# Altium project crypto_OK.PrjPcb
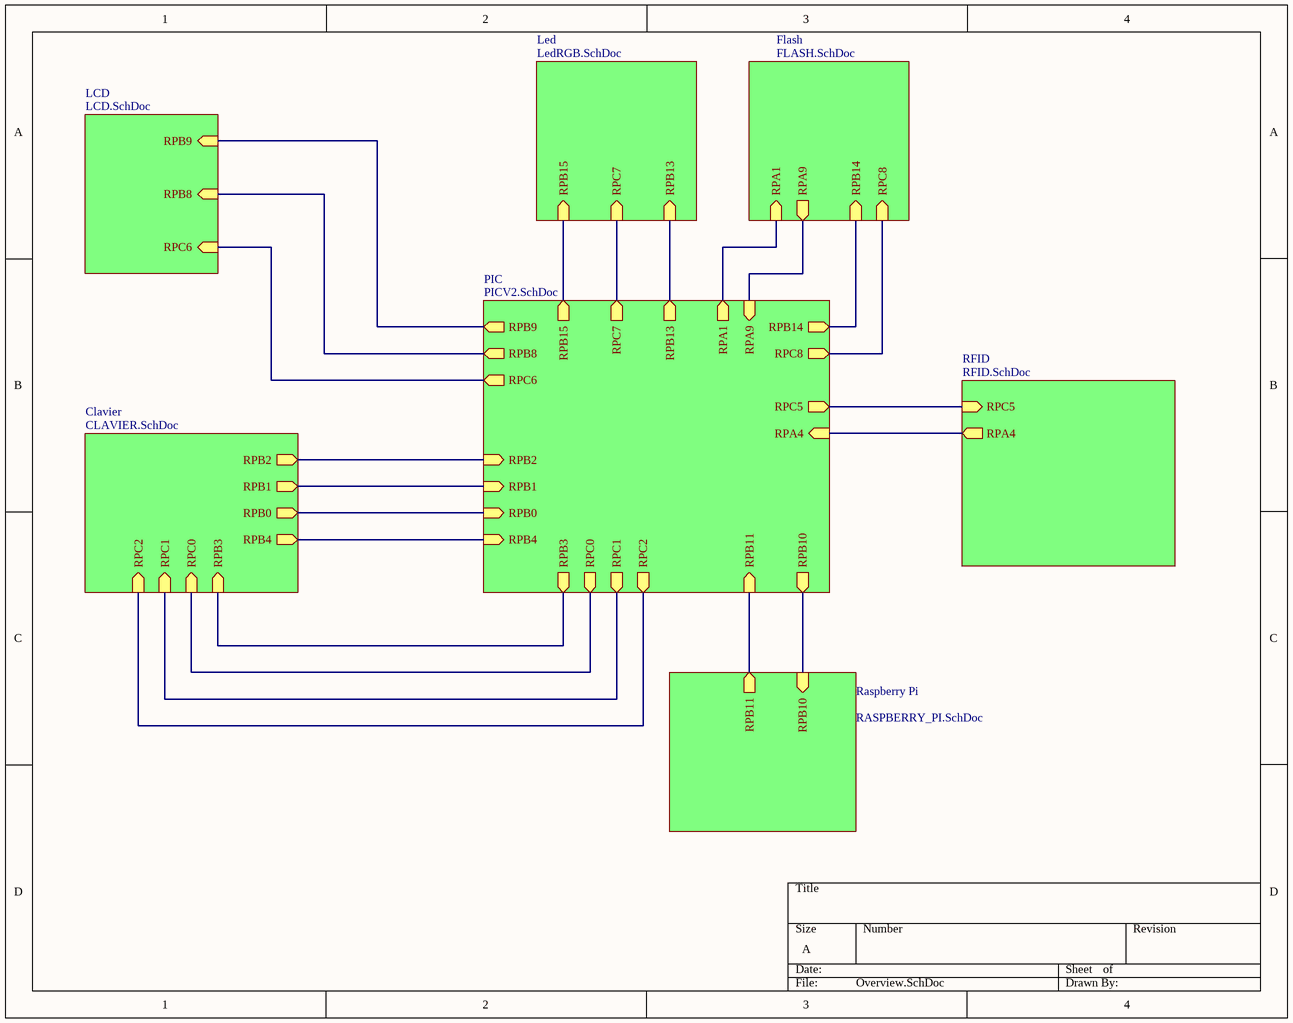
[diagram p0: Overview.SchDoc]
8 sheets, 37 parts. Net scope: hierarchical (ports join the sheet entries above them; power ports are global).
Board files: PCB1.PcbDoc, PCB2.PcbDoc, PCB3.PcbDoc, PCB4.PcbDoc
Sheets:
  Overview.SchDoc
    PIC = PICV2.SchDoc
    LCD = LCD.SchDoc
    Led = LedRGB.SchDoc
    RFID = RFID.SchDoc
    Clavier = CLAVIER.SchDoc
    Raspberry Pi = RASPBERRY_PI.SchDoc
    Flash = FLASH.SchDoc

## Sheet Overview.SchDoc
size A

### Sub-sheets
Clavier = CLAVIER.SchDoc: RPB2 (out), RPB1 (out), RPB0 (out), RPB4 (out), RPC1 (in), RPB3 (in), RPC0 (in), RPC2 (in)
Flash = FLASH.SchDoc: RPA1 (in), RPA9 (out), RPB14 (in), RPC8 (in)
LCD = LCD.SchDoc: RPB9 (in), RPB8 (in), RPC6 (in)
Led = LedRGB.SchDoc: RPB15 (in), RPC7 (in), RPB13 (in)
PIC = PICV2.SchDoc: RPB9 (out), RPB8 (out), RPC6 (out), RPB15 (out), RPC7 (out), RPB13 (out), RPA1 (out), RPA9 (in), RPB14 (out), RPC8 (out), RPC5 (out), RPA4 (in), RPB2 (in), RPB1 (in), RPB0 (in), RPB4 (in), RPB3 (out), RPC0 (out), RPC1 (out), RPC2 (out), RPB11 (in), RPB10 (out)
Raspberry Pi = RASPBERRY_PI.SchDoc: RPB11 (out), RPB10 (in)
RFID = RFID.SchDoc: RPC5 (in), RPA4 (out)

### Nets
NetP1_1: sheet PIC/RPC6, sheet LCD/RPC6
NetP1_12: sheet PIC/RPB8, sheet LCD/RPB8
NetP1_13: sheet PIC/RPB9, sheet LCD/RPB9
NetP4_3: sheet PIC/RPC5, sheet RFID/RPC5
NetP4_4: sheet PIC/RPA4, sheet RFID/RPA4
NetR3_2: sheet PIC/RPB15, sheet Led/RPB15
NetR4_2: sheet PIC/RPC7, sheet Led/RPC7
NetR5_2: sheet PIC/RPB13, sheet Led/RPB13
NetU2_1: sheet PIC/RPA1, sheet Flash/RPA1
NetU2_2: sheet PIC/RPA9, sheet Flash/RPA9
NetU2_5: sheet PIC/RPC8, sheet Flash/RPC8
NetU2_6: sheet PIC/RPB14, sheet Flash/RPB14
NetU3_8: sheet PIC/RPB10, sheet Raspberry Pi/RPB10
NetU3_9: sheet PIC/RPB11, sheet Raspberry Pi/RPB11
NetU3_21: sheet PIC/RPB0, sheet Clavier/RPB0
NetU3_22: sheet PIC/RPB1, sheet Clavier/RPB1
NetU3_23: sheet PIC/RPB2, sheet Clavier/RPB2
NetU3_24: sheet PIC/RPB3, sheet Clavier/RPB3
NetU3_25: sheet PIC/RPC0, sheet Clavier/RPC0
NetU3_26: sheet PIC/RPC1, sheet Clavier/RPC1
NetU3_27: sheet PIC/RPC2, sheet Clavier/RPC2
NetU3_33: sheet PIC/RPB4, sheet Clavier/RPB4

## Sheet PICV2.SchDoc
size B
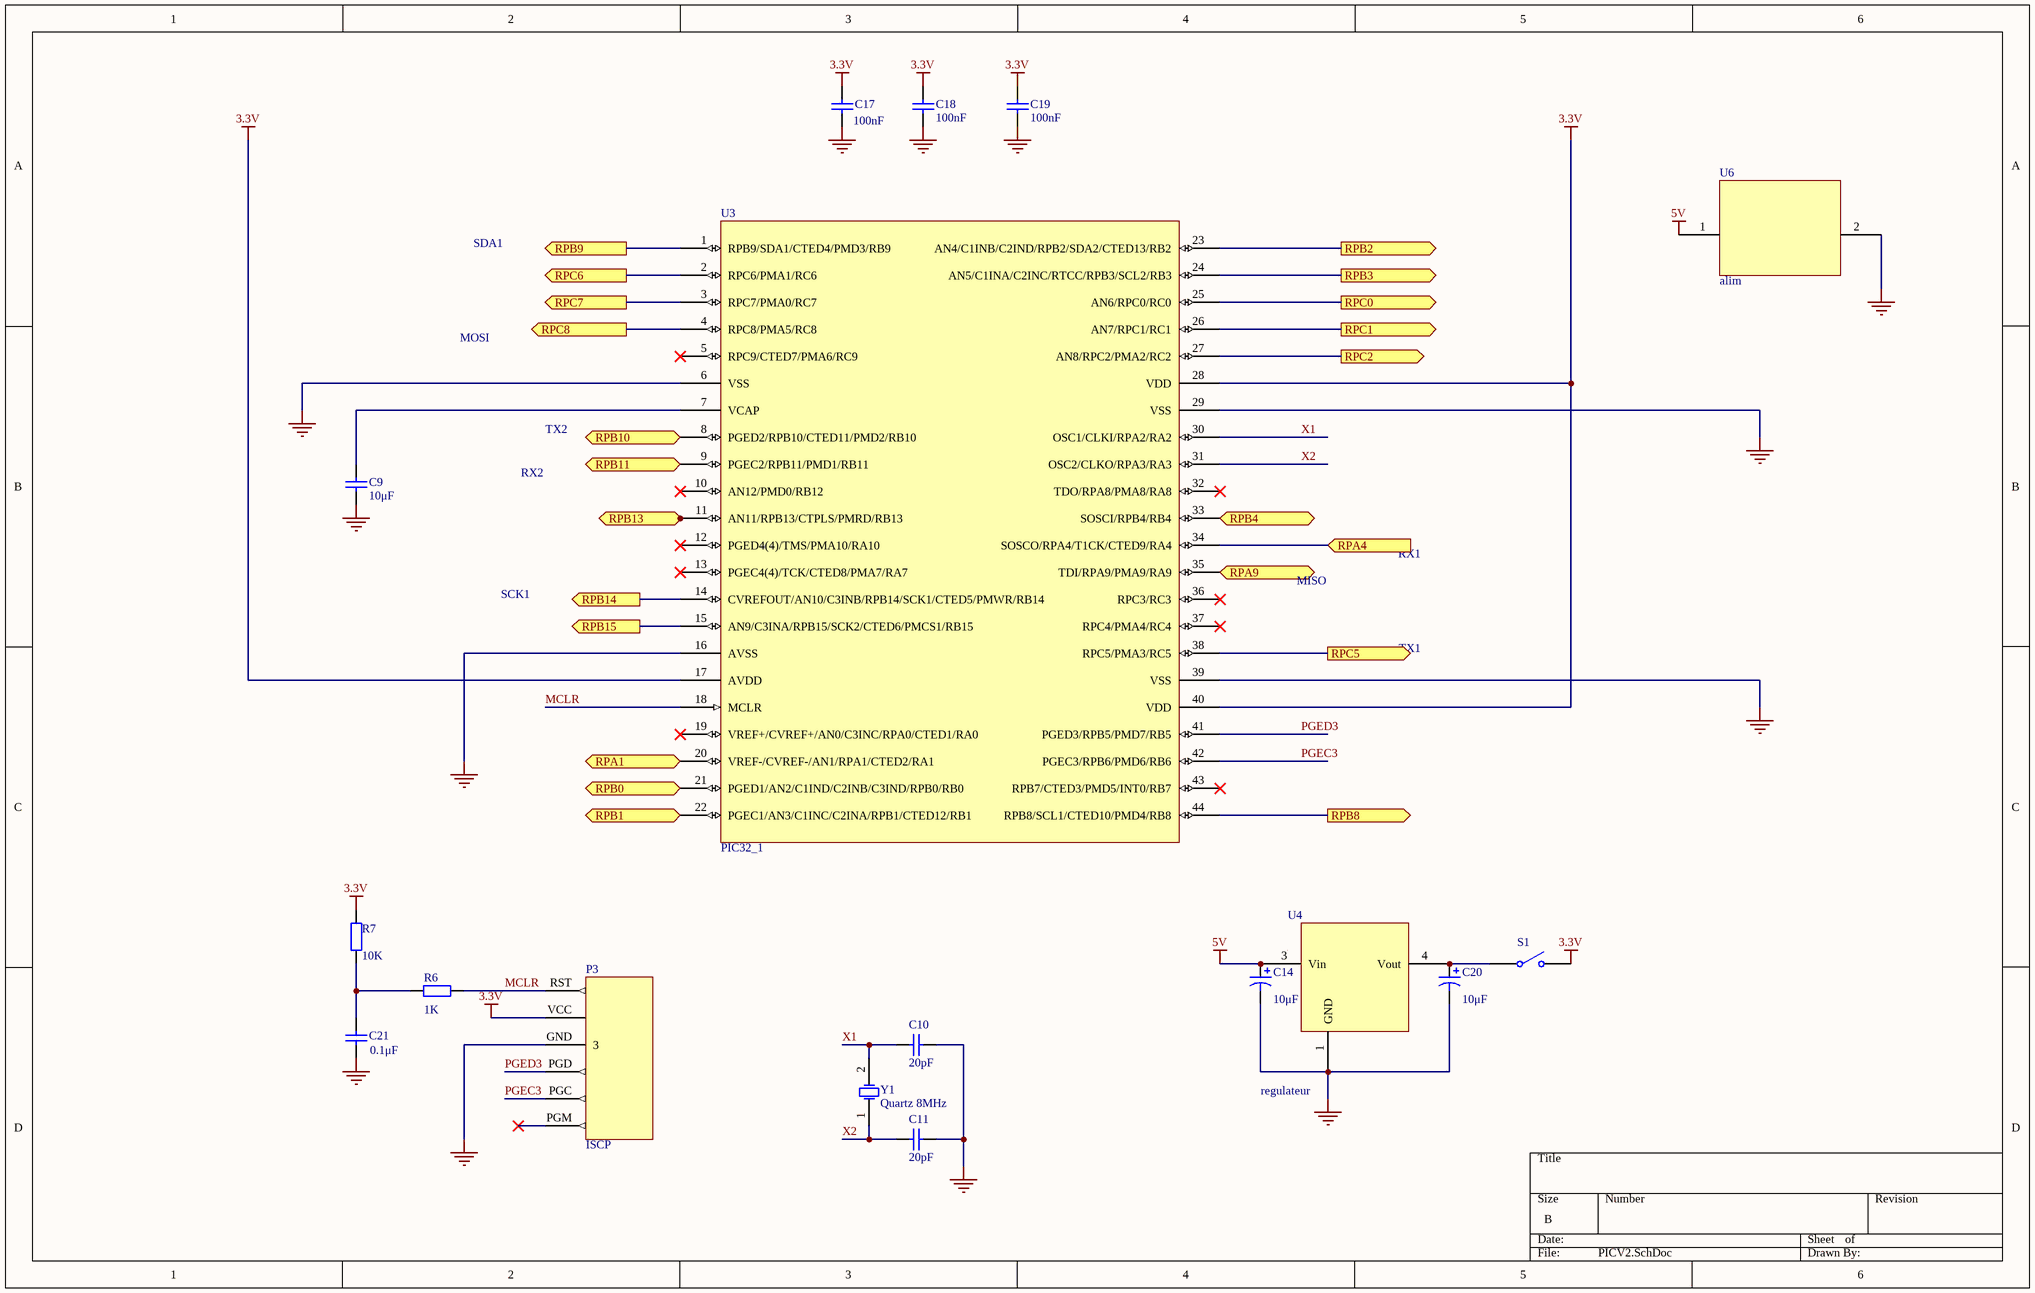
[diagram p1: PICV2.SchDoc]

### Parts
C9  value 10μF  [0603]  (hidden comment: Cap)
C10  value 20pF  [0603]  (hidden comment: Cap)
C11  value 20pF  [0603]  (hidden comment: Cap)
C14  value 10μF  [0603]  (hidden comment: Cap Pol1)
C17  value 100nF  [0603]  (hidden comment: Cap)
C18  value 100nF  [0603]  (hidden comment: Cap)
C19  value 100nF  [0603]  (hidden comment: Cap)
C20  value 10μF  [0603]  (hidden comment: Cap Pol1)
C21  value 0.1μF  [0603]  (hidden comment: Cap)
P3  ISCP  [ISCP]
R6  value 1K  [0603]  (hidden comment: Res2)
R7  value 10K  [0603]  (hidden comment: Res2)
S1  SW-SPST  [SPST-2]  (value not drawn)
U3  PIC32_1  [PIC32]
U4  regulateur  [regulateur]
U6  alim  [Alim]
Y1  Quartz 8MHz  [quartz]

### Ports
RPA1 (out), RPA4 (in), RPA9 (in), RPB0 (out), RPB1 (out), RPB2 (out), RPB3 (out), RPB4 (out), RPB8 (out), RPB9 (out), RPB10 (out), RPB11 (in), RPB13 (out), RPB14 (out), RPB15 (out), RPC0 (out), RPC1 (out), RPC2 (out), RPC5 (out), RPC6 (out), RPC7 (out), RPC8 (out)

### Nets
3.3V: C17.2 C18.1 C19.1 P3.VCC R7.2 S1.2(NO) U3.17(AVDD) U3.28(VDD) U3.40(VDD)
5V: C14.1 U4.3(Vin) U6.1
GND: C9.2 C10.1 C11.1 C14.2 C17.1 C18.2 C19.2 C20.2 C21.1 P3.GND(3) U3.6(VSS) U3.16(AVSS) U3.29(VSS) U3.39(VSS) U4.1(GND) U6.2
MCLR: P3.RST R6.2 U3.18(MCLR)
PGEC3: P3.PGC U3.42(PGEC3/RPB6/PMD6/RB6)
PGED3: P3.PGD U3.41(PGED3/RPB5/PMD7/RB5)
X1: C10.2 U3.30(OSC1/CLKI/RPA2/RA2) Y1.2(OSC2)
X2: C11.2 U3.31(OSC2/CLKO/RPA3/RA3) Y1.1(OSC1)
NetC9_1: C9.1 U3.7(VCAP)
NetC20_1: C20.1 S1.1(COMMON) U4.4(Vout)
NetC21_2: C21.2 R6.1 R7.1
NetP1_1: U3.2(RPC6/PMA1/RC6) ; port RPC6
NetP1_12: U3.44(RPB8/SCL1/CTED10/PMD4/RB8) ; port RPB8
NetP1_13: U3.1(RPB9/SDA1/CTED4/PMD3/RB9) ; port RPB9
NetP4_3: U3.38(RPC5/PMA3/RC5) ; port RPC5
NetP4_4: U3.34(SOSCO/RPA4/T1CK/CTED9/RA4) ; port RPA4
NetR3_2: U3.15(AN9/C3INA/RPB15/SCK2/CTED6/PMCS1/RB15) ; port RPB15
NetR4_2: U3.3(RPC7/PMA0/RC7) ; port RPC7
NetU2_1: U3.20(VREF-/CVREF-/AN1/RPA1/CTED2/RA1) ; port RPA1
NetU2_2: U3.35(TDI/RPA9/PMA9/RA9) ; port RPA9
NetU2_5: U3.4(RPC8/PMA5/RC8) ; port RPC8
NetU2_6: U3.14(CVREFOUT/AN10/C3INB/RPB14/SCK1/CTED5/PMWR/RB14) ; port RPB14
NetU3_8: U3.8(PGED2/RPB10/CTED11/PMD2/RB10) ; port RPB10
NetU3_9: U3.9(PGEC2/RPB11/PMD1/RB11) ; port RPB11
NetU3_21: U3.21(PGED1/AN2/C1IND/C2INB/C3IND/RPB0/RB0) ; port RPB0
NetU3_22: U3.22(PGEC1/AN3/C1INC/C2INA/RPB1/CTED12/RB1) ; port RPB1
NetU3_23: U3.23(AN4/C1INB/C2IND/RPB2/SDA2/CTED13/RB2) ; port RPB2
NetU3_24: U3.24(AN5/C1INA/C2INC/RTCC/RPB3/SCL2/RB3) ; port RPB3
NetU3_25: U3.25(AN6/RPC0/RC0) ; port RPC0
NetU3_26: U3.26(AN7/RPC1/RC1) ; port RPC1
NetU3_27: U3.27(AN8/RPC2/PMA2/RC2) ; port RPC2
NetU3_33: U3.33(SOSCI/RPB4/RB4) ; port RPB4

Not connected (* = marked no-connect by the designer): P3 PGM(6)*; U3 5(RPC9/CTED7/PMA6/RC9)* 10(AN12/PMD0/RB12)* 11(AN11/RPB13/CTPLS/PMRD/RB13) 12(PGED4(4)/TMS/PMA10/RA10)* 13(PGEC4(4)/TCK/CTED8/PMA7/RA7)* 19(VREF+/CVREF+/AN0/C3INC/RPA0/CTED1/RA0)* 32(TDO/RPA8/PMA8/RA8)* 36(RPC3/RC3)* 37(RPC4/PMA4/RC4)* 43(RPB7/CTED3/PMD5/INT0/RB7)*

### Notes on the sheet
- SDA1
- MOSI
- TX2
- RX2
- MISO
- RX1
- SCK1
- TX1

### Library data of the parts
C9-C11 C17-C19 C21 = Cap: Capacitor; Published: 8-Jun-2000; LatestRevisionDate: 17-Jul-2002; LatestRevisionNote: Re-released for DXP Platform.; PackageReference: RAD-0.3; Publisher: Altium Limited; PackageDescription: Radial Cap, Thru-Hole; 2 Leads; 0.3 in Pin Spacing
C14 = Cap Pol1: Polarized Capacitor (Radial); FOURNISSEUR: FARNELL; FABRIQUANT: TDK; REF FABRIQUANT: C1608X5R0J106K080AB; REF FOURNISSEUR: 2346889; Published: 8-Jun-2000; LatestRevisionDate: 17-Jul-2002; LatestRevisionNote: Re-released for DXP Platform.; PackageReference: RB7.6-15; Publisher: Altium Limited; PackageDescription: Polarized Capacitor (Radial); 2 Leads
C20 = Cap Pol1: Polarized Capacitor (Radial); FABRIQUANT: TDK; FOURNISSEUR: FARNELL; REF FABRIQUANT: C1608X5R0J106K080AB; REF FOURNISSEUR: 2346889; Published: 8-Jun-2000; LatestRevisionDate: 17-Jul-2002; LatestRevisionNote: Re-released for DXP Platform.; PackageReference: RB7.6-15; Publisher: Altium Limited; PackageDescription: Polarized Capacitor (Radial); 2 Leads
P3 = ISCP: FOURNISSEUR: Farnell; FABRIQUANT: Molex; REF FOURNISSEUR: 1360134; REF FABRIQUANT: 22-29-2061
R6 R7 = Res2: Resistor; Published: 8-Jun-2000; LatestRevisionDate: 17-Jul-2002; LatestRevisionNote: Re-released for DXP Platform.; PackageReference: AXIAL-0.4; Publisher: Altium Limited; PackageDescription: Axial Device, Thru-Hole; 2 Leads; 0.4 in Pin Spacing
S1 = SW-SPST: Single-Pole, Single-Throw Switch; Published: 24-Mar-1999; LatestRevisionDate: 17-Jul-2002; LatestRevisionNote: Re-released for DXP Platform.; PackageReference: SPST-2; Publisher: Altium Limited; PackageDescription: Switch; 2 Leads
U3 = PIC32_1: FOURNISSEUR: FARNELL; FABRIQUANT: MICROCHIP; REF FOURNISSEUR: PIC32MX170F256D-I/PT; REF FABRIQUANT: 2456845
U4 = regulateur: FOURNISSEUR: FARNELL; FABRIQUANT: TEXAS INSTRUMENTS; REF FABRIQUANT: LM1117DT-3.3/NOPB; REF FOURNISSEUR: 1469048
U6 = alim: FOURNISSEUR: Farnell; FABRIQUANT: Lumberg; REF FABRIQUANT: 1613 09; REF FOURNISSEUR: 1216991
Y1 = XTAL: Crystal Oscillator; FABRIQUANT: FOX ELECTRONICS; FOURNISSEUR: FARNELL; REF FABRIQUANT: FOXSDLF/080-20; REF FOURNISSEUR: 2063972; Published: 8-Jun-2000; LatestRevisionDate: 17-Jul-2002; LatestRevisionNote: Re-released for DXP Platform.; PackageReference: R38; Publisher: Altium Limited; PackageDescription: Crystal, Thru-Hole; 2 Leads; Body 3.1 x 8.2 mm (Dia.xH)

## Sheet LCD.SchDoc
size A
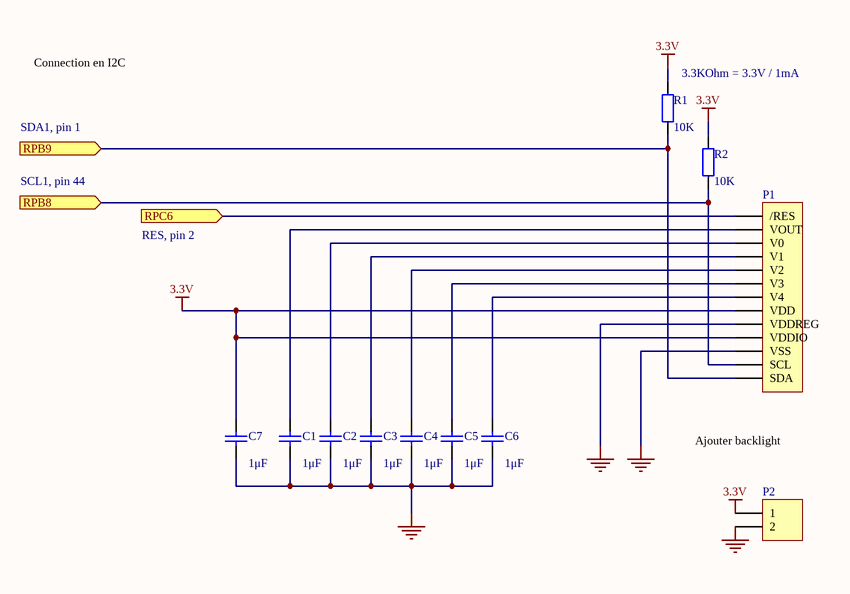
[diagram p2: LCD.SchDoc]

### Parts
C1  value 1μF  [0603]  (hidden comment: Cap)
C2  value 1μF  [0603]  (hidden comment: Cap)
C3  value 1μF  [0603]  (hidden comment: Cap)
C4  value 1μF  [0603]  (hidden comment: Cap)
C5  value 1μF  [0603]  (hidden comment: Cap)
C6  value 1μF  [0603]  (hidden comment: Cap)
C7  value 1μF  [0603]  (hidden comment: Cap)
P1  LCD  [lcd]  (value not drawn)
P2  lcd backlight  [lcd bk]  (value not drawn)
R1  value 10K  [0603]  (hidden comment: Res2)
R2  value 10K  [0603]  (hidden comment: Res2)

### Ports
RPB8 (in), RPB9 (in), RPC6 (in)

### Nets
3.3V: C7.2 P1.8(VDD) P1.10(VDDIO) P2.1 R1.2 R2.2
GND: C1.1 C2.1 C3.1 C4.1 C5.1 C6.1 C7.1 P1.9(VDDREG) P1.11(VSS) P2.2
NetC1_2: C1.2 P1.2(VOUT)
NetC2_2: C2.2 P1.3(V0)
NetC3_2: C3.2 P1.4(V1)
NetC4_2: C4.2 P1.5(V2)
NetC5_2: C5.2 P1.6(V3)
NetC6_2: C6.2 P1.7(V4)
NetP1_1: P1.1(/RES) ; port RPC6
NetP1_12: P1.12(SCL) R2.1 ; port RPB8
NetP1_13: P1.13(SDA) R1.1 ; port RPB9

### Notes on the sheet
- Connection en I2C
- (near R1) 3.3KOhm = 3.3V / 1mA
- SDA1, pin 1
- SCL1, pin 44
- RES, pin 2
- (near P2) Ajouter backlight

### Library data of the parts
C1-C7 = Cap: Capacitor; Published: 8-Jun-2000; LatestRevisionDate: 17-Jul-2002; LatestRevisionNote: Re-released for DXP Platform.; PackageReference: RAD-0.3; Publisher: Altium Limited; PackageDescription: Radial Cap, Thru-Hole; 2 Leads; 0.3 in Pin Spacing
P1 = Header 13: LCD Connector; REF FABRIQUANT: MCCOG42005A6W-BNMLWI; FABRIQUANT: MIDAS; FOURNISSEUR: FARNELL; REF FOURNISSEUR: 2218946; LatestRevisionDate: 17-Jul-2002; LatestRevisionNote: Re-released for DXP Platform.; Publisher: Altium Limited
P2 = Header 2H: Header, 2-Pin, Right Angle; FOURNISSEUR: Farnell; FABRIQUANT: PHOENIX CONTACT; REF FABRIQUANT: 1725656; REF FOURNISSEUR: 3041359
R1 R2 = Res2: Resistor; Published: 8-Jun-2000; LatestRevisionDate: 17-Jul-2002; LatestRevisionNote: Re-released for DXP Platform.; PackageReference: AXIAL-0.4; Publisher: Altium Limited; PackageDescription: Axial Device, Thru-Hole; 2 Leads; 0.4 in Pin Spacing

## Sheet LedRGB.SchDoc
size A
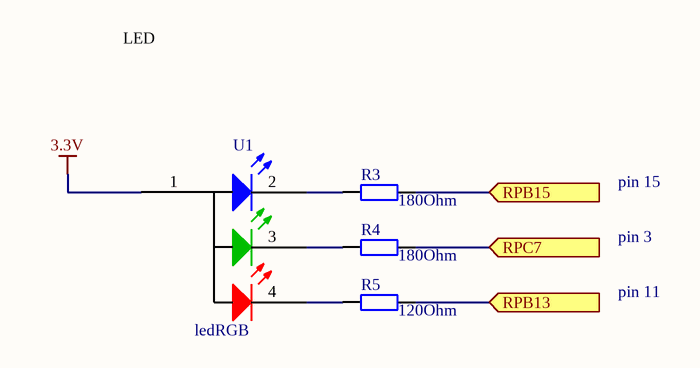
[diagram p3: LedRGB.SchDoc]

### Parts
R3  value 180Ohm  [0603]  (hidden comment: Res2)
R4  value 180Ohm  [0603]  (hidden comment: Res2)
R5  value 120Ohm  [0603]  (hidden comment: Res2)
U1  ledRGB  [LED RGB]

### Ports
RPB13 (in), RPB15 (in), RPC7 (in)

### Nets
3.3V: U1.1
NetR3_1: R3.1 U1.2
NetR3_2: R3.2 ; port RPB15
NetR4_1: R4.1 U1.3
NetR4_2: R4.2 ; port RPC7
NetR5_1: R5.1 U1.4
NetR5_2: R5.2 ; port RPB13

### Notes on the sheet
- LED
- pin 15
- pin 3
- pin 11

### Library data of the parts
R3-R5 = Res2: Resistor; Published: 8-Jun-2000; LatestRevisionDate: 17-Jul-2002; LatestRevisionNote: Re-released for DXP Platform.; PackageReference: AXIAL-0.4; Publisher: Altium Limited; PackageDescription: Axial Device, Thru-Hole; 2 Leads; 0.4 in Pin Spacing
U1 = ledRGB: FABRIQUANT: MIDAS; FOURNISSEUR: FARNELL; REF FABRIQUANT: AMB-MTB0-0A3A2; REF FOURNISSEUR: 2401105

## Sheet RFID.SchDoc
size A
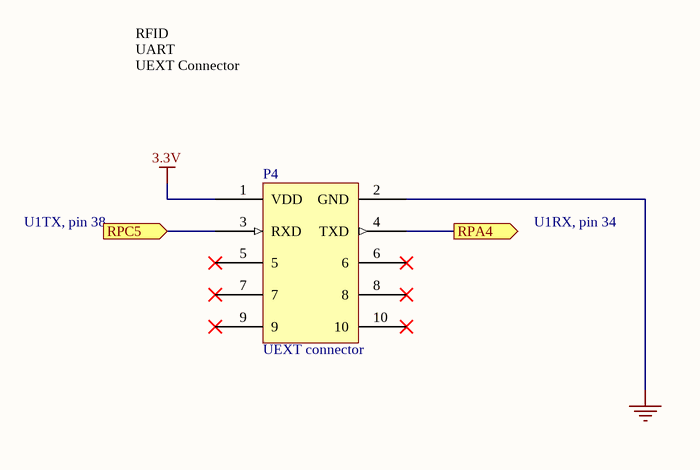
[diagram p4: RFID.SchDoc]

### Parts
P4  UEXT connector  [Conneteur UEXT]

### Ports
RPA4 (out), RPC5 (in)

### Nets
3.3V: P4.1(VDD)
GND: P4.2(GND)
NetP4_3: P4.3(RXD) ; port RPC5
NetP4_4: P4.4(TXD) ; port RPA4

Not connected (* = marked no-connect by the designer): P4 5* 6* 7* 8* 9* 10*

### Notes on the sheet
- RFID
  UART
  UEXT Connector
- U1TX, pin 38
- U1RX, pin 34

### Library data of the parts
P4 = UEXT connector: FABRIQUANT: OLIMEX; REF FABRIQUANT: MOD-RFID1356MIFARE; FOURNISSEUR: OLIMEX; REF FOURNISSEUR: MOD-RFID1356MIFARE

## Sheet CLAVIER.SchDoc
size A
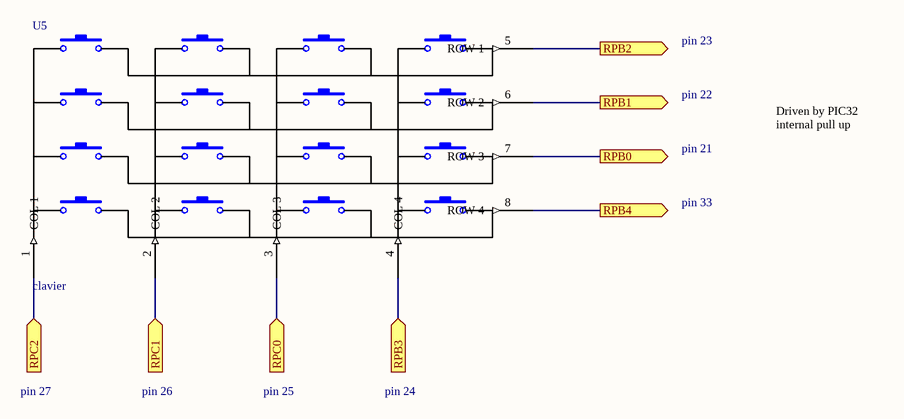
[diagram p5: CLAVIER.SchDoc]

### Parts
U5  clavier  [keypad]

### Ports
RPB0 (out), RPB1 (out), RPB2 (out), RPB3 (in), RPB4 (out), RPC0 (in), RPC1 (in), RPC2 (in)

### Nets
NetU3_21: U5.7(ROW_3) ; port RPB0
NetU3_22: U5.6(ROW_2) ; port RPB1
NetU3_23: U5.5(ROW_1) ; port RPB2
NetU3_24: U5.4(COL_4) ; port RPB3
NetU3_25: U5.3(COL_3) ; port RPC0
NetU3_26: U5.2(COL_2) ; port RPC1
NetU3_27: U5.1(COL_1) ; port RPC2
NetU3_33: U5.8(ROW_4) ; port RPB4

### Notes on the sheet
- pin 23
- pin 22
- Driven by PIC32
  internal pull up
- pin 21
- pin 33
- pin 27
- pin 26
- pin 25
- pin 24

### Library data of the parts
U5 = clavier: FABRIQUANT: MULTICOMP; FOURNISSEUR: FARNELL; REF FABRIQUANT: MCAK1604NBWB; REF FOURNISSEUR: 1182239

## Sheet RASPBERRY_PI.SchDoc
size A
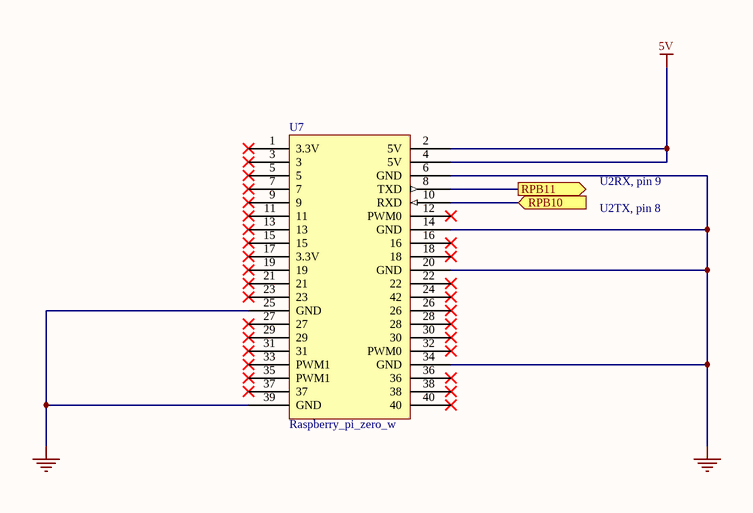
[diagram p6: RASPBERRY_PI.SchDoc]

### Parts
U7  Raspberry_pi_zero_w  [RASPB]

### Ports
RPB10 (in), RPB11 (out)

### Nets
5V: U7.2(5V) U7.4(5V)
GND: U7.6(GND) U7.14(GND) U7.20(GND) U7.25(GND) U7.34(GND) U7.39(GND)
NetU3_8: U7.10(RXD) ; port RPB10
NetU3_9: U7.8(TXD) ; port RPB11

Not connected (* = marked no-connect by the designer): U7 1(3.3V)* 3* 5* 7* 9* 11* 12(PWM0)* 13* 15* 16* 17(3.3V)* 18* 19* 21* 22* 23* 24(42)* 26* 27* 28* 29* 30* 31* 32(PWM0)* 33(PWM1)* 35(PWM1)* 36* 37* 38* 40*

### Notes on the sheet
- U2RX, pin 9
- U2TX, pin 8

### Library data of the parts
U7 = Raspberry_pi_zero_w: REF FABRIQUANT: X

## Sheet FLASH.SchDoc
size A
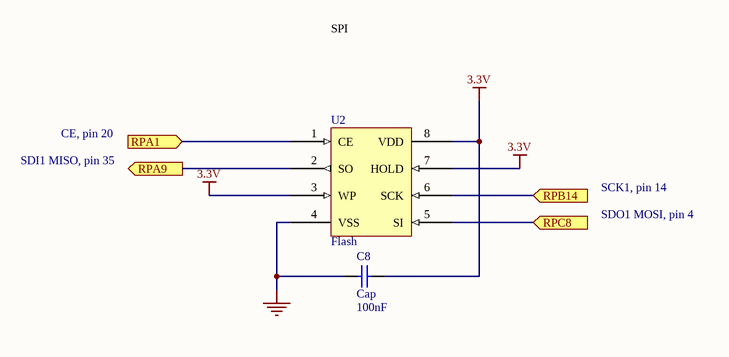
[diagram p7: FLASH.SchDoc]

### Parts
C8  Cap  value 100nF  [0603]
U2  Flash  [flash]

### Ports
RPA1 (in), RPA9 (out), RPB14 (in), RPC8 (in)

### Nets
3.3V: C8.2 U2.3(WP) U2.7(HOLD) U2.8(VDD)
GND: C8.1 U2.4(VSS)
NetU2_1: U2.1(CE) ; port RPA1
NetU2_2: U2.2(SO) ; port RPA9
NetU2_5: U2.5(SI) ; port RPC8
NetU2_6: U2.6(SCK) ; port RPB14

### Notes on the sheet
- SPI
- CE, pin 20
- SDI1 MISO, pin 35
- SCK1, pin 14
- SDO1 MOSI, pin 4

### Library data of the parts
C8 = Cap: Capacitor; Published: 8-Jun-2000; LatestRevisionDate: 17-Jul-2002; LatestRevisionNote: Re-released for DXP Platform.; PackageReference: RAD-0.3; Publisher: Altium Limited; PackageDescription: Radial Cap, Thru-Hole; 2 Leads; 0.3 in Pin Spacing
U2 = Flash: FABRIQUANT: MICROCHIP; FOURNISSEUR: FARNELL; REF FABRIQUANT: SST25VF010A-33-4C-SAE; REF FOURNISSEUR: 1829949

## Nets that join several sheets
3.3V: PICV2 (9 pins), LCD (6 pins), LedRGB (U1.1), RFID (P4.1), FLASH (C8.2 U2.3 U2.7 U2.8)
5V: PICV2 (C14.1 U4.3 U6.1), RASPBERRY_PI (U7.2 U7.4)
GND: PICV2 (16 pins), LCD (10 pins), RFID (P4.2), RASPBERRY_PI (6 pins), FLASH (C8.1 U2.4)
NetP1_1: PICV2 (U3.2), LCD (P1.1)
NetP1_12: PICV2 (U3.44), LCD (P1.12 R2.1)
NetP1_13: PICV2 (U3.1), LCD (P1.13 R1.1)
NetP4_3: PICV2 (U3.38), RFID (P4.3)
NetP4_4: PICV2 (U3.34), RFID (P4.4)
NetR3_2: PICV2 (U3.15), LedRGB (R3.2)
NetR4_2: PICV2 (U3.3), LedRGB (R4.2)
NetU2_1: PICV2 (U3.20), FLASH (U2.1)
NetU2_2: PICV2 (U3.35), FLASH (U2.2)
NetU2_5: PICV2 (U3.4), FLASH (U2.5)
NetU2_6: PICV2 (U3.14), FLASH (U2.6)
NetU3_8: PICV2 (U3.8), RASPBERRY_PI (U7.10)
NetU3_9: PICV2 (U3.9), RASPBERRY_PI (U7.8)
NetU3_21: PICV2 (U3.21), CLAVIER (U5.7)
NetU3_22: PICV2 (U3.22), CLAVIER (U5.6)
NetU3_23: PICV2 (U3.23), CLAVIER (U5.5)
NetU3_24: PICV2 (U3.24), CLAVIER (U5.4)
NetU3_25: PICV2 (U3.25), CLAVIER (U5.3)
NetU3_26: PICV2 (U3.26), CLAVIER (U5.2)
NetU3_27: PICV2 (U3.27), CLAVIER (U5.1)
NetU3_33: PICV2 (U3.33), CLAVIER (U5.8)